# Altium schematic sheet MCU.SchDoc
size A4
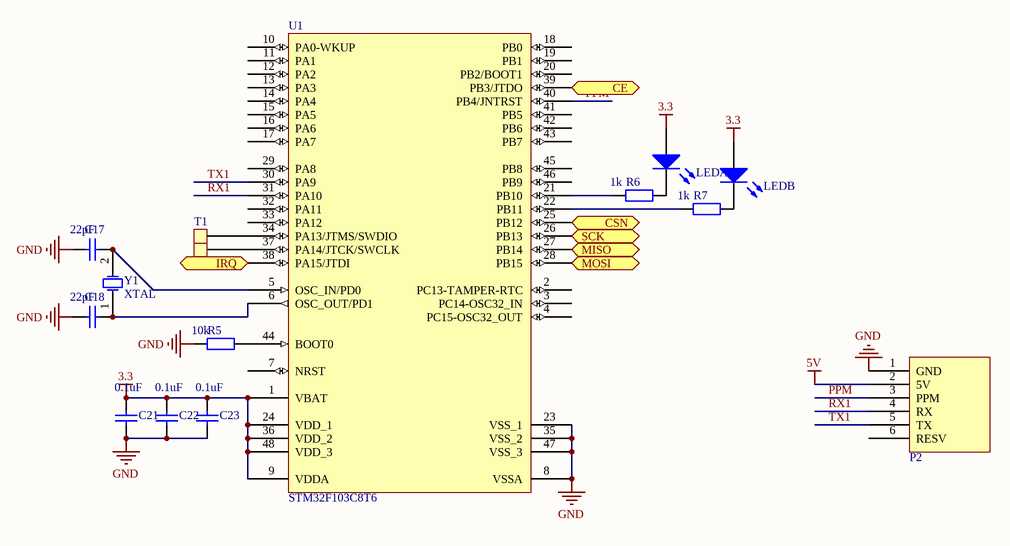
[diagram p0: MCU.SchDoc]

## Parts
C17  22pF  [0402]
C18  22pF  [0402]
C21  0.1uF  [0402]
C22  0.1uF  [0402]
C23  0.1uF  [0402]
LED  LEDx2  [LC-0603_Rx2]  (value not drawn)  (parts A,B of 2)
P2  PPMInf  [PPMInf]  (value not drawn)
R5  10k  [0402]
R6  1k  [0402]
R7  1k  [0402]
T1  TestPad  [TestPad - 1mm]  (value not drawn)
T2  TestPad  [TestPad - 1mm]  (value not drawn)
U1  STM32F103C8T6  [LQFP48_L]
Y1  XTAL  [5032-crystal]

## Ports
CE, CSN, IRQ, MISO, MOSI, SCK

## Nets
3.3: C21.1 C22.1 C23.1 LED.1(A) LED.2(A) U1.1(VBAT) U1.9(VDDA) U1.24(VDD_1) U1.36(VDD_2) U1.48(VDD_3)
5V: P2.2(5V)
GND: C17.1 C18.1 C21.2 C22.2 C23.2 P2.1(GND) R5.1 U1.8(VSSA) U1.23(VSS_1) U1.35(VSS_2) U1.47(VSS_3)
CE: U1.39(PB3/JTDO) ; port CE
CSN: U1.25(PB12) ; port CSN
IRQ: U1.38(PA15/JTDI) ; port IRQ
MISO: U1.27(PB14) ; port MISO
MOSI: U1.28(PB15) ; port MOSI
PPM: P2.3(PPM) U1.40(PB4/JNTRST)
RX1: P2.4(RX) U1.31(PA10)
SCK: U1.26(PB13) ; port SCK
TX1: P2.5(TX) U1.30(PA9)
NetC17_2: C17.2 U1.5(OSC_IN/PD0) Y1.2(OSC2)
NetC18_2: C18.2 U1.6(OSC_OUT/PD1) Y1.1(OSC1)
NetLED_3: LED.3(K) R6.2
NetLED_4: LED.4(K) R7.2
NetR5_2: R5.2 U1.44(BOOT0)
NetR6_1: R6.1 U1.21(PB10)
NetR7_1: R7.1 U1.22(PB11)
NetT1_1: T1.1 U1.34(PA13/JTMS/SWDIO)
NetT2_1: T2.1 U1.37(PA14/JTCK/SWCLK)

Not connected (* = marked no-connect by the designer): P2 6(RESV); U1 2(PC13-TAMPER-RTC) 3(PC14-OSC32_IN) 4(PC15-OSC32_OUT) 7(NRST) 10(PA0-WKUP) 11(PA1) 12(PA2) 13(PA3) 14(PA4) 15(PA5) 16(PA6) 17(PA7) 18(PB0) 19(PB1) 20(PB2/BOOT1) 29(PA8) 32(PA11) 33(PA12) 41(PB5) 42(PB6) 43(PB7) 45(PB8) 46(PB9)

## Library data of the parts
C17 C18 C21-C23 = Cap: Capacitor; Published: 8-Jun-2000; LatestRevisionDate: 17-Jul-2002; LatestRevisionNote: Re-released for DXP Platform.; PackageReference: RAD-0.3; Publisher: Altium Limited; PackageDescription: Radial Cap, Thru-Hole; 2 Leads; 0.3 in Pin Spacing
LED = LEDx2: Typical RED GaAs LED; Published: 8-Jun-2000; LatestRevisionDate: 08-Jul-2005; LatestRevisionNote: Mech Layer 1 removed.; PackageReference: LED-1; Publisher: Altium Limited; PackageDescription: LED; 2 Leads
R5-R7 = Res2: Resistor; Value: 22k 1%; Published: 8-Jun-2000; LatestRevisionDate: 17-Jul-2002; LatestRevisionNote: Re-released for DXP Platform.; PackageReference: AXIAL-0.4; Publisher: Altium Limited; PackageDescription: Axial Device, Thru-Hole; 2 Leads; 0.4 in Pin Spacing
U1 = STM32F103C8T6: STM32 ARM-based 32-bit MCU with 64 Kbytes Flash, 48-pin LQFP, Industrial Temperature; Published: *; DatasheetVersion: *; PackageVersion: *; PackageReference: *; Publisher: *; PackageDescription: *; ComponentLink1Description: *; ComponentLink1URL: *; ComponentLink2Description: *; ComponentLink2URL: *
Y1 = XTAL: Crystal Oscillator; Published: 8-Jun-2000; LatestRevisionDate: 17-Jul-2002; LatestRevisionNote: Re-released for DXP Platform.; PackageReference: R38; Publisher: Altium Limited; PackageDescription: Crystal, Thru-Hole; 2 Leads; Body 3.1 x 8.2 mm (Dia.xH)